# EasyEDA Pro project 立创·地阔星STM32F103C8T6开发板.eprj

# Schematic F103
Board Name: 地阔星STM32F103C8T6开发板; Create Date: 2024-06-13; Page Name: core; Project Name: 立创·地阔星STM32F103C8T6开发板; Schematic Name: F103; Update Date: 2024-06-13; BladeWidth: 10; Company: 嘉立创EDA; Page Size: A4; RegionStart: 1; Reviewed: 嘉立创EDA; ShowBorder: 1; TitleBlock: 1; TitleBlockPosition: 3; XRegionCount: 6; YRegionCount: 4
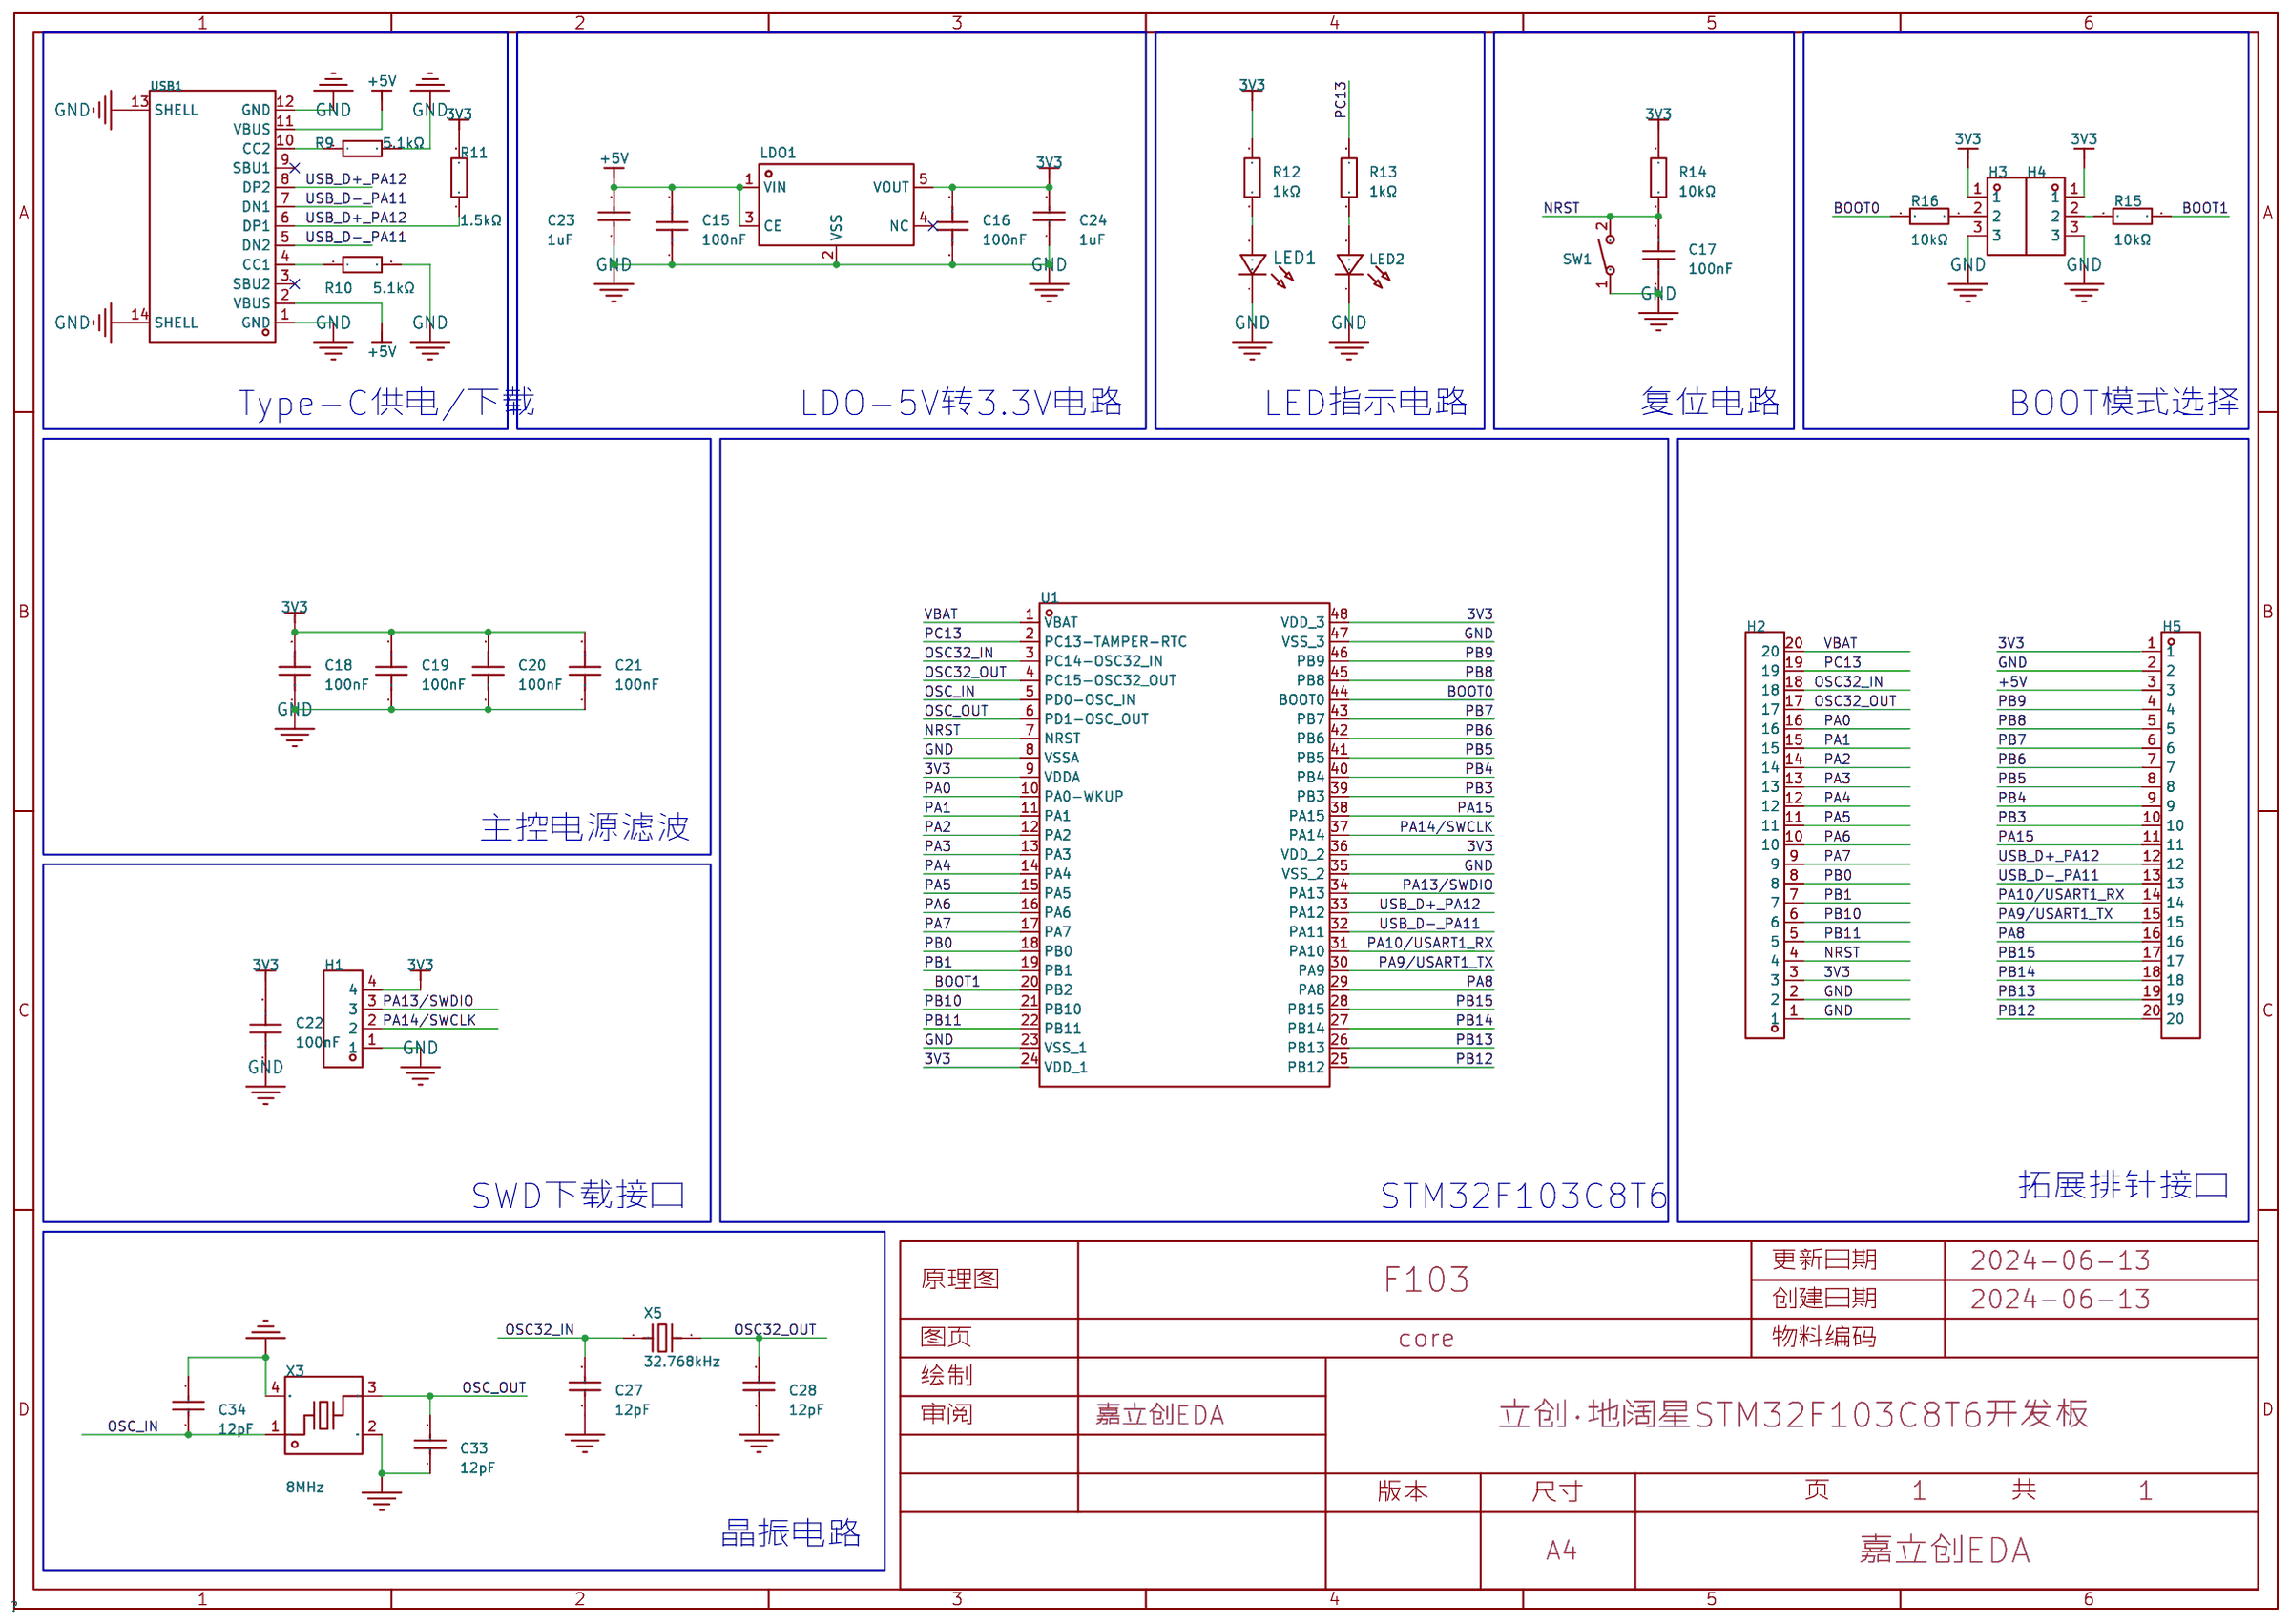
[diagram p0: schematic sheet]

## Parts
C15  100nF  [R0402]
C16  100nF  [R0402]
C17  100nF  [R0402]
C18  100nF  [R0402]
C19  100nF  [R0402]
C20  100nF  [R0402]
C21  100nF  [R0402]
C22  100nF  [R0402]
C23  1uF  [R0402]
C24  1uF  [R0402]
C27  12pF  [R0402]
C28  12pF  [R0402]
C33  12pF  [R0402]
C34  12pF  [R0402]
H1  -  [HDR-TH_4P-P2.54-V-M]
H2  -  [HDR-TH_20P-P2.54-V-M-1]
H3  -  [HDR-TH_3P-P2.54-V-M]
H4  -  [HDR-TH_3P-P2.54-V-M]
H5  -  [HDR-TH_20P-P2.54-V-M-1]
LDO1  ME6211C33M5G-N  [SOT-23-5_L3.0-W1.7-P0.95-LS2.8-BL]
LED1  -  [LED_0603]
LED2  -  [LED_0603]
R9  5.1kΩ  [R0402]
R10  5.1kΩ  [R0402]
R11  1.5kΩ  [R0402]
R12  1kΩ  [R0402]
R13  1kΩ  [R0402]
R14  10kΩ  [R0402]
R15  10kΩ  [R0402]
R16  10kΩ  [R0402]
SW1  TS-1101-B-W  [KEY-SMD_2P-L6.0-W3.6-P7.4-LS8.0-L]
U1  STM32F103C8T6  [LQFP-48_L7.0-W7.0-P0.50-LS9.0-BL]
USB1  TYPE-C 16PIN 2MD(073)  [USB-C-SMD_TYPE-C-6PIN-2MD-073]
X3  8MHz  [CRYSTAL-SMD_4P-L3.2-W2.5-BL-1]
X5  32.768kHz  [OSC-SMD_L3.2-W1.5]

## Library data of the parts
C15-C22 = GRM155R71H104KE14D: 容值:100nF;精度:±10%;额定电压:50V;材质(温度系数):X7R;; LCSC Part Name: 100nF ±10% 50V; Supplier Part: C77020; Manufacturer: muRata(村田); Supplier Footprint: 0402; JLCPCB Part Class: 扩展库; Datasheet: https://atta.szlcsc.com/upload/public/pdf/source/20180326/C77020_39BD49C951FF1AF0DB1F1FAC5AC1E401.pdf; Supplier: LCSC; Tolerance: ±10%; Voltage Rated: 50V; Temperature Coefficient: X7R
C23 C24 = CL05A105KP5NNNC: 容值:1uF;精度:±10%;额定电压:10V;材质(温度系数):X5R;; LCSC Part Name: 1uF ±10% 10V; Supplier Part: C14445; Manufacturer: SAMSUNG(三星); Supplier Footprint: 0402; JLCPCB Part Class: 扩展库; Datasheet: https://atta.szlcsc.com/upload/public/pdf/source/20160218/1457707763339.pdf; Supplier: LCSC; Tolerance: ±10%; Voltage Rated: 10V; Temperature Coefficient: X5R
C27 C28 C33 C34 = 0402CG120J500NT: 容值:12pF;精度:±5%;额定电压:50V;材质(温度系数):C0G;; LCSC Part Name: 12pF ±5% 50V; Supplier Part: C1547; Manufacturer: FH(风华); Supplier Footprint: 0402; JLCPCB Part Class: 基础库; Datasheet: https://atta.szlcsc.com/upload/public/pdf/source/20200305/C486355_26A10D38EF8C2A5C37091D0039909270.pdf; Supplier: LCSC; Tolerance: ±5%; Voltage Rated: 50V; Temperature Coefficient: C0G
H1 = HDR-M_2.54_1x4P: Supplier Part: C2935929; Supplier Footprint: 插件
H2 H5 = HDR-M_2.54_1x20P: 间距:2.54mm;总PIN位数:20;排数:1;插针结构:-;行距:-;安装类型:直插;圆针/方针:-;额定电流:-;额定电压:-;配合针长度:-;塑高:-;触头材质:黄铜;触头镀层:-;颜色:黑色;; Supplier Part: C50981; Supplier Footprint: 插件
H3 H4 = HDR-M_2.54_1x3P: Supplier Part: C2937625; Supplier Footprint: 插件
LDO1 = ME6211C33M5G-N: 输出类型:固定;输出极性:正;最大输入电压:6V;输出电压:3.3V;输出电流:500mA;电源纹波抑制比(PSRR):70dB;; Supplier Part: C82942; Manufacturer: MICRONE(南京微盟); Supplier Footprint: SOT-23-5; JLCPCB Part Class: 扩展库; Datasheet: https://atta.szlcsc.com/upload/public/pdf/source/20170918/C82942_1505727073070976520.pdf; Supplier: LCSC; Output Type: 固定; Output Polarity: 正; Number of Outputs: 1; Maximum Input Voltage: 6V; Output Voltage: 3.3V; Dropout Voltage: 260mV@(200mA); Output Current: 500mA; Power Supply Rejection Ratio (PSRR): 70dB
LED1 = LED_0603-R: Supplier Footprint: 0603; Supplier Part: C84263
LED2 = LED_0603-B: Supplier Footprint: 0603; Supplier Part: C84266
R9 R10 = 0402WGF5101TCE: 电阻类型:厚膜电阻;阻值:5.1kΩ;精度:±1%;功率:62.5mW;最大工作电压:50V;温度系数:±100ppm/℃;; LCSC Part Name: 5.1kΩ ±1% 62.5mW 厚膜电阻; Supplier Part: C25905; Manufacturer: UNI-ROYAL(厚声); Supplier Footprint: 0402; JLCPCB Part Class: 基础库; Datasheet: https://atta.szlcsc.com/upload/public/pdf/source/20200306/C422600_1E6D84923E4A46A82E41ADD87F860B5C.pdf; Supplier: LCSC; Type: 厚膜电阻; Tolerance: ±1%; Power(Watts): 62.5mW; Overload Voltage (Max): 50V; Temperature Coefficient: ±100ppm/℃; Operating Temperature Range: -55℃~+155℃
R11 = 0402WGF1501TCE: 电阻类型:厚膜电阻;阻值:1.5kΩ;精度:±1%;功率:62.5mW;最大工作电压:50V;温度系数:±100ppm/℃;; LCSC Part Name: 1.5kΩ ±1% 62.5mW 厚膜电阻; Supplier Part: C25867; Manufacturer: UNI-ROYAL(厚声); Supplier Footprint: 0402; JLCPCB Part Class: 基础库; Datasheet: https://atta.szlcsc.com/upload/public/pdf/source/20200306/C422600_1E6D84923E4A46A82E41ADD87F860B5C.pdf; Supplier: LCSC; Type: 厚膜电阻; Tolerance: ±1%; Power(Watts): 62.5mW; Overload Voltage (Max): 50V; Temperature Coefficient: ±100ppm/℃; Operating Temperature Range: -55℃~+155℃
R12 R13 = 0402WGF1001TCE: 电阻类型:厚膜电阻;阻值:1kΩ;精度:±1%;功率:62.5mW;最大工作电压:50V;温度系数:±100ppm/℃;; LCSC Part Name: 1kΩ ±1% 62.5mW 厚膜电阻; Supplier Part: C11702; Manufacturer: UNI-ROYAL(厚声); Supplier Footprint: 0402; JLCPCB Part Class: 基础库; Datasheet: https://atta.szlcsc.com/upload/public/pdf/source/20200306/C422600_1E6D84923E4A46A82E41ADD87F860B5C.pdf; Supplier: LCSC; Type: 厚膜电阻; Tolerance: ±1%; Power(Watts): 62.5mW; Overload Voltage (Max): 50V; Temperature Coefficient: ±100ppm/℃; Operating Temperature Range: -55℃~+155℃
R14-R16 = RC0402FR-0710KL: 电阻类型:厚膜电阻;阻值:10kΩ;精度:±1%;功率:62.5mW;最大工作电压:50V;温度系数:±100ppm/℃;; LCSC Part Name: 厚膜电阻 10kΩ ±1% 62.5mW; Supplier Part: C60490; Manufacturer: YAGEO(国巨); Supplier Footprint: 0402; JLCPCB Part Class: 扩展库; Datasheet: https://atta.szlcsc.com/upload/public/pdf/source/20170925/C131467_1506321478108990263.pdf; Supplier: LCSC; Type: 厚膜电阻; Tolerance: ±1%; Power(Watts): 62.5mW; Overload Voltage (Max): 50V; Temperature Coefficient: ±100ppm/℃; Operating Temperature Range: -55℃~+155℃
SW1 = TS-1101-B-W_C500065: 触点电流:50mA;额定电压(DC):12V;绝缘电阻:-;电路结构:单刀单掷;安装方式:立贴;带灯:无;作用力:160gf;机械寿命:5万次;带支架:否;; LCSC Part Name: 6*3.6*2.5mm 立贴 轻触开关; Supplier Part: C500065; Manufacturer: XKB Connectivity(中国星坤); Supplier Footprint: SMD; JLCPCB Part Class: 扩展库; Datasheet: https://atta.szlcsc.com/upload/public/pdf/source/20211011/D0E0CAF534F7B19DDE4CE68748A25BD3.pdf; Supplier: LCSC; Contact Current: 50mA; Voltage Rating (DC): 12V; Circuit: 单刀单掷; Mounting Style: 立贴; Actuator Style: 矩形按钮; Actuator/Cap Color: 白色; With Lamp: 无; Operating Force: 160gf; Mechanical Life: 5万次; Operating Temperature: -30℃~+85℃; Switch Length: 6mm; Switch Width: 3.6mm; Switch Height: 2.5mm; Strike Gundam: 否
U1 = STM32F103C8T6: CPU内核:CM3;程序存储容量:64KB;RAM总容量:20KB;GPIO端口数量:37;工作电压范围:2V~3.6V;CPU最大主频:72MHz;程序存储器类型:FLASH;; LCSC Part Name: STM32F103C8T6 MSL=3; Supplier Part: C8734; Manufacturer: ST(意法半导体); Supplier Footprint: LQFP-48(7x7); JLCPCB Part Class: 扩展库; Datasheet: https://atta.szlcsc.com/upload/public/pdf/source/20220812/8363ACEC51AD55ECEB84799464F7CB85.pdf; Supplier: LCSC; CPU Core: CM3; Program Storage Size: 64KB; RAM Size: 20KB; GPIO Ports Number: 37; Operating Voltage Range: 2V~3.6V; CPU Maximum Speed: 72MHz; Program Memory Type: FLASH; Operating Temperature Range: -40℃~+85℃; ADC (Bit): 12bit; Universal Serial Bus: 有; Peripheral/Function: 看门狗；DMA；看门狗；片载温度传感器; Watchdog: 有; Infrared Data Association: 有; Low-Voltage Detect: 有; Direct Memory Access: 有; Internal Oscillator: 有
USB1 = TYPE-C 16PIN 2MD(073): 连接器类型:Type-C;标准:-;公母:母座;触点数量:16;端口数量:1;安装方式:卧贴;额定电流 - 电源:5A;工作温度范围:-25℃~+85℃;; LCSC Part Name: TYPE-C母座 16P 4脚插件带定位柱 不锈钢外壳 2次模顶; Supplier Part: C2765186; Manufacturer: SHOU HAN(首韩); Supplier Footprint: SMD; JLCPCB Part Class: 扩展库; Supplier: LCSC; Connector Type: Type-C; Gender: 母座; Number of Contacts: 16; Number of Ports: 1; Mounting Style: 卧贴; Current Rating - Power (Max): 5A; Operating Temperature Range: -25℃~+85℃
X3 = XL2EL89COI-111YLC-8M: 晶振类型:贴片晶振;频率:8MHz;常温频差:±10ppm;外接负载电容:12pF;频率稳定度(全温):±20ppm;; LCSC Part Name: 8MHz ±10ppm 12pF; Supplier Part: C2973805; Manufacturer: YXC(扬兴晶振); Supplier Footprint: SMD3225-4P; JLCPCB Part Class: 扩展库; Datasheet: https://atta.szlcsc.com/upload/public/pdf/source/20240329/19D5F850207469550BEB00D7DFEDBC7A.pdf; Supplier: LCSC; Crystal Type: 贴片晶振; Normal temperature Frequency Tolerance: ±10ppm; External load capacitor: 12pF; Frequency Stability(Full temperature range): ±20ppm; Equivalent Series Resistance (ESR): 150Ω; Operating Temperature: -40℃~+85℃
X5 = X321532768KGD2SI: 晶振类型:贴片晶振;频率:32.768kHz;常温频差:±20ppm;外接负载电容:12.5pF;频率稳定度(全温):-;; LCSC Part Name: 32.768kHz ±20ppm 12.5pF; Supplier Part: C620155; Manufacturer: YXC(扬兴晶振); Supplier Footprint: SMD3215-2P; JLCPCB Part Class: 扩展库; Datasheet: https://atta.szlcsc.com/upload/public/pdf/source/20240329/3A7650FD985DD0DE85694D3785AB4916.pdf; Supplier: LCSC; Crystal Type: 贴片晶振; Normal temperature Frequency Tolerance: ±20ppm; External load capacitor: 12.5pF; Operating Temperature: -40℃~+85℃

## Nets
3V3: C16.2 C18.2 C19.2 C20.2 C21.2 C22.2 C24.2 H1.4 H2.3 H3.1 H4.1 H5.1 LDO1.5(VOUT) R11.2 R12.2 R14.2 U1.9(VDDA) U1.24(VDD_1) U1.36(VDD_2) U1.48(VDD_3)
+5V: C15.2 C23.2 H5.3 LDO1.1(VIN) LDO1.3(CE) USB1.2(VBUS) USB1.11(VBUS)
GND: C15.1 C16.1 C17.1 C18.1 C19.1 C20.1 C21.1 C22.1 C23.1 C24.1 C27.1 C28.1 C33.1 C34.2 H1.1 H2.1 H2.2 H3.3 H4.3 H5.2 LDO1.2(VSS) LED1.1(C) LED2.1(C) R9.2 R10.2 SW1.1 U1.8(VSSA) U1.23(VSS_1) U1.35(VSS_2) U1.47(VSS_3) USB1.1(GND) USB1.12(GND) USB1.13(SHELL) USB1.14(SHELL) X3.2(GND) X3.4(GND)
VBAT: H2.20 U1.1(VBAT)
BOOT0: R16.2 U1.44(BOOT0)
BOOT1: R15.1 U1.20(PB2)
NRST: C17.2 H2.4 R14.1 SW1.2 U1.7(NRST)
OSC32_IN: C27.2 H2.18 U1.3(PC14-OSC32_IN) X5.1
OSC32_OUT: C28.2 H2.17 U1.4(PC15-OSC32_OUT) X5.2
OSC_IN: C34.1 U1.5(PD0-OSC_IN) X3.1
OSC_OUT: C33.2 U1.6(PD1-OSC_OUT) X3.3
PA0: H2.16 U1.10(PA0-WKUP)
PA1: H2.15 U1.11(PA1)
PA2: H2.14 U1.12(PA2)
PA3: H2.13 U1.13(PA3)
PA4: H2.12 U1.14(PA4)
PA5: H2.11 U1.15(PA5)
PA6: H2.10 U1.16(PA6)
PA7: H2.9 U1.17(PA7)
PA8: H5.16 U1.29(PA8)
PA9/USART1_TX: H5.15 U1.30(PA9)
PA10/USART1_RX: H5.14 U1.31(PA10)
PA13/SWDIO: H1.3 U1.34(PA13)
PA14/SWCLK: H1.2 U1.37(PA14)
PA15: H5.11 U1.38(PA15)
PB0: H2.8 U1.18(PB0)
PB1: H2.7 U1.19(PB1)
PB3: H5.10 U1.39(PB3)
PB4: H5.9 U1.40(PB4)
PB5: H5.8 U1.41(PB5)
PB6: H5.7 U1.42(PB6)
PB7: H5.6 U1.43(PB7)
PB8: H5.5 U1.45(PB8)
PB9: H5.4 U1.46(PB9)
PB10: H2.6 U1.21(PB10)
PB11: H2.5 U1.22(PB11)
PB12: H5.20 U1.25(PB12)
PB13: H5.19 U1.26(PB13)
PB14: H5.18 U1.27(PB14)
PB15: H5.17 U1.28(PB15)
PC13: H2.19 R13.2 U1.2(PC13-TAMPER-RTC)
USB_D+_PA12: H5.12 R11.1 U1.33(PA12) USB1.6(DP1) USB1.8(DP2)
USB_D-_PA11: H5.13 U1.32(PA11) USB1.5(DN2) USB1.7(DN1)
$1N2054: R9.1 USB1.10(CC2)
$1N2066: R10.1 USB1.4(CC1)
$1N2074: LED1.2(A) R12.1
$1N2077: LED2.2(A) R13.1
$1N3296: H4.2 R15.2
$1N11047: H3.2 R16.1

Not connected (* = marked no-connect by the designer): LDO1 4(NC)*; USB1 3(SBU2)* 9(SBU1)*

## Notes on the sheet
- Type-C供电/下载
- LDO-5V转3.3V电路
- LED指示电路
- 复位电路
- BOOT模式选择
- 主控电源滤波
- SWD下载接口
- STM32F103C8T6
- 拓展排针接口
- 晶振电路

# Board PCB
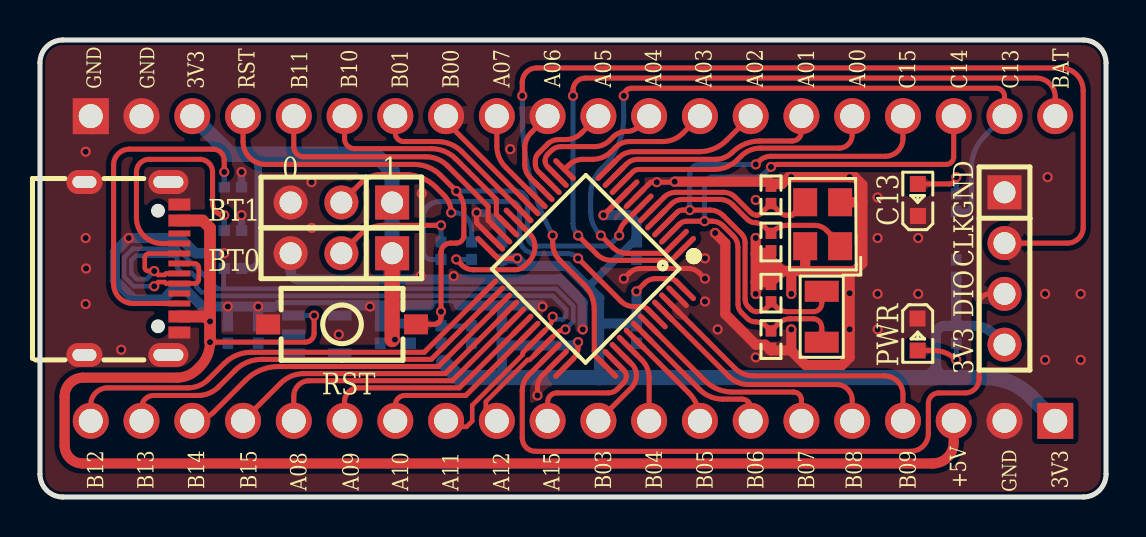
[diagram p1: board, top side]
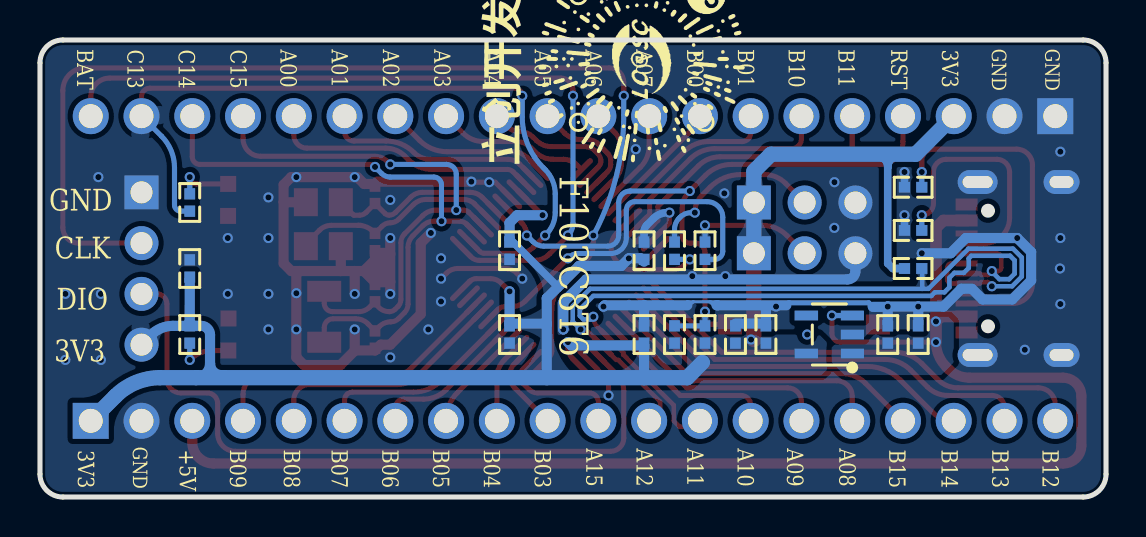
[diagram p2: board, bottom side, seen from below]

Outline 53.34 x 22.86 mm; copper layers: Top Layer, Bottom Layer. Coordinates in mm from the lower left corner of the outline.
Outline path: 0,21.72 0,1.14 arc(0.33,0.33) 1.14,0 52.2,0 arc(53.01,0.33) 53.34,1.14 53.34,21.72 arc(53.01,22.53) 52.2,22.86 1.14,22.86 arc(0.33,22.53) 0,21.72
Stack: Top Layer 0.035mm - / Dielectric1 1.51mm FR4 er 4.5 / Bottom Layer 0.035mm -

## Design rules (mm)
net USB_D-_PA11: DP1
net USB_D+_PA12: DP1
spacing copperThickness1oz (default): track to track 0.102, other pairs 0.152 to 0.3
spacing copperThickness2oz: track to track 0.203, other pairs 0.152 to 0.3
spacing Plane_innerPlane: track to track 0.102, other pairs 0.152 to 0.3
spacing Copper_copperRegion: track to track 0.102, other pairs 0.152 to 0.3
track width copperThickness1oz (default): min 0.152, default 0.254, max 2.54
track width copperThickness2oz: min 0.152, default 0.254, max 2.54
differential pair differentialPair (default): width min 0.229, default 0.229, max 0.229; gap min 0.127, default 0.127
pour e748 uses Copper_copperRegion
pour e750 uses Copper_copperRegion
pour e752 uses Copper_copperRegion
pour e767 uses Copper_copperRegion

## Placement (name value [footprint] x y rotation side)
C15  100nF  [R0402]  10.92 8.13 270 bottom
C16  100nF  [R0402]  17.02 8.13 270 bottom
C17  100nF  [R0402]  21.59 8.13 90 bottom
C18  100nF  [R0402]  23.11 8.13 270 bottom
C19  100nF  [R0402]  23.11 12.32 270 bottom
C20  100nF  [R0402]  29.84 12.32 90 bottom
C21  100nF  [R0402]  29.84 8.13 90 bottom
C22  100nF  [R0402]  45.85 11.43 270 bottom
C23  1uF  [R0402]  9.4 8.13 270 bottom
C24  1uF  [R0402]  18.54 8.13 270 bottom
C27  12pF  [R0402]  36.58 7.88 90 top
C28  12pF  [R0402]  36.58 10.2 270 top
C33  12pF  [R0402]  36.58 15.11 270 top
C34  12pF  [R0402]  36.58 12.75 270 top
H1  -  [HDR-TH_4P-P2.54-V-M]  48.26 11.43 270 top
H2  -  [HDR-TH_20P-P2.54-V-M-1]  26.67 19.05 0 top
H3  -  [HDR-TH_3P-P2.54-V-M]  15.08 12.19 180 top
H4  -  [HDR-TH_3P-P2.54-V-M]  15.08 14.73 180 top
H5  -  [HDR-TH_20P-P2.54-V-M-1]  26.67 3.81 180 top
LDO1  ME6211C33M5G-N  [SOT-23-5_L3.0-W1.7-P0.95-LS2.8-BL]  13.84 8.13 90 bottom
LED1  -  [LED_0603]  43.92 8.08 270 top
LED2  -  [LED_0603]  43.92 14.91 90 top
R9  5.1kΩ  [R0402]  9.65 15.49 0 bottom
R10  5.1kΩ  [R0402]  9.65 13.33 0 bottom
R11  1.5kΩ  [R0402]  9.65 11.43 0 bottom
R12  1kΩ  [R0402]  45.85 8.13 90 bottom
R13  1kΩ  [R0402]  45.85 14.73 270 bottom
R14  10kΩ  [R0402]  20.07 8.13 270 bottom
R15  10kΩ  [R0402]  21.59 12.32 90 bottom
R16  10kΩ  [R0402]  20.07 12.32 270 bottom
SW1  TS-1101-B-W  [KEY-SMD_2P-L6.0-W3.6-P7.4-LS8.0-L]  15.11 8.64 0 top
U1  STM32F103C8T6  [LQFP-48_L7.0-W7.0-P0.50-LS9.0-BL]  27.31 11.43 135 top
USB1  TYPE-C 16PIN 2MD(073)  [USB-C-SMD_TYPE-C-6PIN-2MD-073]  4.6 11.43 270 top
X3  8MHz  [CRYSTAL-SMD_4P-L3.2-W2.5-BL-1]  39.16 13.64 90 top
X5  32.768kHz  [OSC-SMD_L3.2-W1.5]  39.12 9.02 90 top

## Footprints (pads in the part's own frame, mm; a bottom-side part is the same pattern mirrored in y, then rotated)
CRYSTAL-SMD_4P-L3.2-W2.5-BL-1
  rect 1.4x1.2 smd: 1(-1.1,-0.875) 2(1.1,-0.875) 3(1.1,0.875) 4(-1.1,0.875)
HDR-TH_3P-P2.54-V-M
  rect 1.7x1.7 hole 1.1: 1(-2.54,0)
  round 1.7 hole 1.1: 2(0,0) 3(2.54,0)
HDR-TH_4P-P2.54-V-M
  rect 1.7x1.7 hole 1.1: 1(-3.81,0)
  round 1.7 hole 1.1: 2(-1.27,0) 3(1.27,0) 4(3.81,0)
HDR-TH_20P-P2.54-V-M-1
  rect 1.8x1.8 hole 1.2: 1(-24.13,0)
  round 1.8 hole 1.2: 2(-21.59,0) 3(-19.05,0) 4(-16.51,0) 5(-13.97,0) 6(-11.43,0) 7(-8.89,0) 8(-6.35,0) 9(-3.81,0) 10(-1.27,0) 11(1.27,0) 12(3.81,0) 13(6.35,0) 14(8.89,0) 15(11.43,0) 16(13.97,0) 17(16.51,0) 18(19.05,0) 19(21.59,0) 20(24.13,0)
KEY-SMD_2P-L6.0-W3.6-P7.4-LS8.0-L
  rect 1.2x1 smd: 1(-3.7,0) 2(3.7,0)
LED_0603
  rect 0.8x0.8 smd: 1(-0.851,-0.01) 2(0.75,-0.005)
LQFP-48_L7.0-W7.0-P0.50-LS9.0-BL
  oval 0.27x1.5 smd: 1(-2.75,-4.25) 2(-2.25,-4.25) 3(-1.75,-4.25) 4(-1.25,-4.25) 5(-0.75,-4.25) 6(-0.25,-4.25) 7(0.25,-4.25) 8(0.75,-4.25) 9(1.25,-4.25) 10(1.75,-4.25) 11(2.25,-4.25) 12(2.75,-4.25) 25(2.75,4.25) 26(2.25,4.25) 27(1.75,4.25) 28(1.25,4.25) 29(0.75,4.25) 30(0.25,4.25) 31(-0.25,4.25) 32(-0.75,4.25) 33(-1.25,4.25) 34(-1.75,4.25) 35(-2.25,4.25) 36(-2.75,4.25)
  oval 1.5x0.27 smd: 13(4.25,-2.75) 14(4.25,-2.25) 15(4.25,-1.75) 16(4.25,-1.25) 17(4.25,-0.75) 18(4.25,-0.25) 19(4.25,0.25) 20(4.25,0.75) 21(4.25,1.25) 22(4.25,1.75) 23(4.25,2.25) 24(4.25,2.75) 37(-4.25,2.75) 38(-4.25,2.25) 39(-4.25,1.75) 40(-4.25,1.25) 41(-4.25,0.75) 42(-4.25,0.25) 43(-4.25,-0.25) 44(-4.25,-0.75) 45(-4.25,-1.25) 46(-4.25,-1.75) 47(-4.25,-2.25) 48(-4.25,-2.75)
OSC-SMD_L3.2-W1.5
  rect 1.05x1.7 smd: 1(-1.275,0) 2(1.275,0)
R0402
  rect 0.566x0.54 smd: 1(-0.433,0) 2(0.433,0)
SOT-23-5_L3.0-W1.7-P0.95-LS2.8-BL
  rect 0.49x1.157 smd: 1(-0.95,-1.153) 2(0,-1.153) 3(0.95,-1.153)
  rect 0.49x1.175 smd: 4(0.95,1.153) 5(-0.95,1.153)
USB-C-SMD_TYPE-C-6PIN-2MD-073
  rect 0.6x1.1 smd: 1(-3.2,2.375) 2(-2.4,2.375) 11(2.4,2.375) 12(3.2,2.375)
  rect 0.3x1.1 smd: 3(-1.75,2.375) 4(-1.25,2.375) 5(-0.75,2.375) 6(-0.25,2.375) 7(0.25,2.375) 8(0.75,2.375) 9(1.25,2.375) 10(1.75,2.375)
  oval 1.2x2 hole 0.6x1.5: 13(-4.325,1.825) 14(4.325,1.825)
  oval 1.2x1.8 hole 0.6x1.2: 13(-4.325,-2.375) 14(4.325,-2.375)

## Nets
As in the schematic.

Pads without a net: LDO1 4; USB1 3 9

## Via types
v1: diameter 0.508, hole 0.305, Top Layer to Bottom Layer, 85 vias

## Routing (per net, layer and track width the routed paths; a pad name or vN(x,y) marks a point on that pad's centre or on a via; arc(x,y) is an arc through that point)
3V3: length 102.9
  Top Layer w0.254: v1(23.88,11.94) 22.91,11.94 U1.24 ; U1.36 26.7,6.94 arc(26.87,7.18) 26.92,7.48 v1(26.92,7.75) ; U1.48 31.83,10.79 arc(31.69,10.89) 31.52,10.92 30.8,10.92 arc(30.5,10.86) 30.26,10.7 v1(29.84,10.29)
  Top Layer w0.28: v1(28.19,14.1) 28.2,14.1 U1.9
  Top Layer w0.762: H3.1 17.62,7.87
  Bottom Layer w0.381: 10.09,11.43 10.67,11.43 10.92,11.68 10.92,16.51 ; 27.43,10.5 27.43,10.52 29.78,12.86 29.84,12.86 ; 10.92,16.64 10.92,17.02 ; 10.92,16.64 10.92,16.51 ; 10.92,16.64 arc(10.81,16.91) 10.54,17.02 ; 10.92,16.51 arc(11.07,16.87) 11.43,17.02 ; 10.92,16.51 arc(10.77,16.87) 10.41,17.02
  Bottom Layer w0.508: 27.98,8.67 27.98,5.97 ; 27.98,8.67 27.99,8.67 29.84,8.67 v1(29.84,10.29) ; 27.98,8.67 27.98,9.95 26.37,11.56 24.26,11.56 v1(23.88,11.94) 23.28,11.94 23.11,11.77 ; R12.2 46.7,8.56 arc(47.27,8.45) 47.76,8.12 H1.4 ; R12.2 45.85,10.89 ; R12.2 45.28,8.56 arc(44.96,8.43) 44.83,8.11 44.83,6.67 ; v1(26.92,7.75) 26.76,7.58 23.11,7.58 23.11,5.97 ; v1(28.19,14.1) 29.46,14.1 29.84,13.72 29.84,12.86 ; 44.83,6.67 44.83,6.1 ; 44.83,6.67 arc(44.66,6.26) 44.26,6.1 44.07,6.1 ; 44.83,6.67 arc(45.04,6.17) 45.53,5.97
  Bottom Layer w0.762: H5.1 49.56,5.05 arc(48.54,5.73) 47.34,5.97 20.96,5.97 20.19,6.73 ; H3.1 H4.1 17.62,16.29 16.76,17.14 9.53,17.14 H2.3
  vias: v1(17.76,7.87)
+5V: length 74.4
  Top Layer w0.254: v1(8.51,7.75) 13.27,7.75 arc(13.59,7.88) 13.72,8.19 v1(13.72,9.08)
  Top Layer w0.508: H5.3 45.72,2.73 arc(45.41,1.99) 44.67,1.68 2.13,1.68 arc(1.5,1.94) 1.23,2.58 1.23,5.04 arc(1.5,5.7) 2.16,5.97 6.84,5.97 arc(7.4,6.08) 7.88,6.4 8,6.52 arc(8.38,7.08) v1(8.51,7.75)
  Top Layer w0.584: USB1.11 8.26,9.03 v1(8.51,8.78) ; USB1.2 8.14,13.83 8.51,13.46 v1(8.51,8.78) ; v1(8.51,8.78) v1(8.51,7.75)
  Bottom Layer w0.254: LDO1.3 v1(13.72,9.08) 13.72,9.02
GND: length 115.3
  Top Layer w0.254: v1(21.85,14.22) 21.85,13.71 U1.23 ; U1.8 30.56,15.75 v1(30.86,15.75) 31.73,15.75 v1(31.76,15.77) ; v1(24.89,5.08) 24.89,5.49 arc(24.96,5.81) 25.14,6.08 25.89,6.83 ; v1(29.21,10.92) 29.48,11.2 arc(29.74,11.37) 30.05,11.43 32.45,11.43 arc(32.74,11.37) 32.99,11.2 v1(33.27,10.92)
  Top Layer w0.508: 41.15,14.75 41.15,11.68 40.77,11.3 40.36,11.3 ; 41.15,14.75 41.15,15.62 40.77,16 v1(40.51,16) 37.47,16 37.12,15.66 36.58,15.66 36.46,15.77 v1(31.76,15.77) ; 41.15,14.75 arc(41.14,14.75) 41.13,14.74 X3.2 ; v1(35.81,10.16) 35.81,10.76 ; 35.81,10.76 35.81,12.15 ; 35.81,10.76 35.83,10.74 36.58,10.74 ; 36.58,12.21 C34.2 arc(36.52,12.27) 36.48,12.21 ; 36.58,12.21 36.48,12.21 ; 36.58,12.21 36.58,11.86 ; 35.81,12.15 v1(35.81,12.95) ; 35.81,12.15 35.87,12.21 36.48,12.21 ; 36.58,10.74 36.58,11.86 ; 36.58,10.74 37.13,11.3 ; 37.6,11.3 37.59,11.3 v1(37.59,10.16) ; 37.6,11.3 37.13,11.3 ; 37.6,11.3 38.3,11.3 ; 37.58,7.33 36.58,7.33 36.29,7.62 35.82,7.62 34.29,9.15 34.29,12.7 v1(33.78,13.21) ; 37.58,7.33 37.59,7.35 v1(37.59,8.38) ; 37.58,7.33 38.3,6.6 40.13,6.6 40.51,6.98 v1(40.51,8.39) v1(40.51,10.19) 40.51,11.15 40.36,11.3 ; 36.19,11.05 36.19,11.4 arc(36.27,11.83) 36.48,12.21 ; 37.13,11.3 36.58,11.86 ; 40.36,11.3 38.3,11.3 ; X3.4 38.29,11.34 arc(38.29,11.32) 38.3,11.3
  Bottom Layer w0.152: 20.96,9.59 20.96,9.77 20.66,9.77 ; 20.66,9.77 19.82,9.77 ; 20.66,9.77 20.8,9.62 20.82,9.62 ; 19.82,9.77 19.43,9.77 19.43,9.59 ; 19.82,9.77 19.65,9.6
  Bottom Layer w0.254: 16,9.59 15.88,9.72 11.87,9.72 11.56,9.4
  Bottom Layer w0.381: 10.09,15.49 v1(10.09,16.26) ; 23.11,12.86 23.11,13.28 arc(23.08,13.45) 22.99,13.59 22.64,13.93 arc(22.32,14.15) 21.94,14.22 v1(21.85,14.22) ; 10.09,13.33 v1(10.09,14.1)
  Bottom Layer w0.508: 23.11,9.59 23.11,9.58 23.11,8.67 ; 23.11,9.59 20.96,9.59 ; 23.11,9.59 25.08,9.59 v1(25.15,9.53) ; 16,9.59 19.49,9.59 ; 11.67,9.51 10.94,9.51 v1(10.92,9.53) ; v1(10.92,9.53) v1(9.4,9.53) ; v1(10.92,9.53) 10.92,8.67 ; 18.54,8.67 17.02,8.67 17.02,9.53 ; v1(9.4,9.53) 8.13,9.53 7.24,10.41 6.71,10.41 6.18,9.88 4.69,9.88 3.75,10.83 3.75,12.26 v1(4.44,12.95) 7.01,12.95 7.78,12.19 v1(9.22,12.19) ; v1(9.4,9.53) 9.4,8.67 ; H3.3 12.54,11.29 arc(12.66,11) 12.94,10.88 26.01,10.88 27.15,9.74 27.15,8.39 v1(27.16,8.38)
  vias: v1(2.29,17.27) v1(2.29,12.95) v1(2.31,11.43) v1(2.29,9.65) v1(4.06,7.37) v1(13.59,15.75) v1(13.59,13.46) v1(14.95,8.13) v1(16.51,9.53) v1(19.1,15.19) v1(19.05,11.05) v1(20.7,11.05) v1(23.53,17.4) v1(33.27,11.94) v1(33.27,9.78) v1(33.91,8.38) v1(35.81,14.86) v1(35.81,6.98) v1(37.59,16) v1(41.91,14.99) v1(41.91,12.95) v1(41.91,10.16) v1(41.91,8.38) v1(43.94,12.95) v1(43.94,10.16) v1(50.29,10.16) v1(50.29,6.86) v1(50.42,16) v1(52.07,10.16) v1(52.07,6.86)
VBAT: length 39.4
  Top Layer w0.254: H2.20 50.8,20.01 arc(50.52,20.68) 49.85,20.95 27.28,20.95 arc(26.85,20.78) 26.67,20.35 v1(26.67,20.07) ; U1.1 31.77,12 arc(31.58,11.88) 31.36,11.84 28.61,11.84 arc(28.2,11.92) 27.86,12.15 v1(26.92,13.08)
  Bottom Layer w0.254: v1(26.67,20.07) 26.67,13.69 arc(26.74,13.36) v1(26.92,13.08)
BOOT0: length 18.3
  Top Layer w0.254: v1(26.92,11.94) 29.07,9.8 arc(29.37,9.6) 29.72,9.53 30.06,9.53 arc(30.26,9.49) 30.42,9.38 U1.44
  Bottom Layer w0.254: R16.2 19.58,11.89 arc(19.29,12) 19.18,12.29 19.18,13.99 arc(19.41,14.54) 19.96,14.77 23.58,14.77 arc(23.88,14.65) 24,14.35 24,12.95 arc(24.23,12.41) 24.78,12.18 26.4,12.18 arc(26.66,12.13) 26.88,11.98 v1(26.92,11.94)
BOOT1: length 7.3
  Top Layer w0.254: v1(20.83,11.89) 21.12,11.6 arc(21.37,11.43) 21.67,11.37 23.8,11.37 arc(24.04,11.42) 24.25,11.56 24.45,11.76 arc(24.68,12.11) 24.76,12.52 arc(24.69,12.88) 24.49,13.18 U1.20
  Bottom Layer w0.254: R15.1 v1(20.83,11.89)
NRST: length 36.6
  Top Layer w0.254: SW1.2 19.71,8.64 arc(19.96,8.74) 20.07,8.99 v1(20.07,9.27) 20.07,12.23 arc(20.2,12.56) 20.54,12.7 20.83,12.7 arc(21.1,12.81) 21.21,13.08 21.21,14.41 arc(21.11,14.89) 20.85,15.29 v1(20.83,15.31) 20.04,16.09 arc(19.44,16.49) 18.72,16.64 11.3,16.64 arc(10.49,16.97) 10.16,17.78 H2.4 ; U1.7 29.25,13.73 arc(29.05,13.43) v1(28.98,13.08)
  Bottom Layer w0.254: 21.59,8.67 21.48,8.56 R14.1 v1(20.07,9.27) ; v1(28.98,13.08) 28.67,12.77 arc(28.42,12.6) 28.14,12.55 24.93,12.55 arc(24.54,12.71) 24.38,13.09 24.38,14.73 arc(24.22,15.14) 23.81,15.31 v1(20.83,15.31)
OSC32_IN: length 30.1
  Top Layer w0.254: H2.18 45.72,17.02 arc(45.61,16.75) 45.34,16.64 36.88,16.64 arc(36.72,16.6) v1(36.58,16.51) ; U1.3 32.01,13.66 arc(32.16,13.76) 32.34,13.79 v1(33.25,13.79) 33.63,13.79 arc(33.93,13.73) 34.19,13.56 34.68,13.07 arc(34.86,12.8) 34.93,12.48 34.93,9.65 arc(34.97,9.42) 35.1,9.22 35.4,8.92 arc(35.58,8.81) 35.79,8.76 arc(36.1,8.7) 36.36,8.53 36.58,8.31 36.93,8.66 arc(37.21,8.85) 37.54,8.92 38.68,8.92 arc(38.99,8.79) 39.12,8.48 X5.1
  Bottom Layer w0.254: v1(33.25,13.79) 33.25,15.62 arc(33.36,15.89) 33.63,16 35.8,16 arc(36.05,16.05) 36.25,16.19 v1(36.58,16.51)
OSC32_OUT: length 27.9
  Top Layer w0.254: U1.4 31.88,14.24 arc(32.01,14.32) 32.15,14.35 v1(32.51,14.35) 33.52,14.35 arc(33.88,14.28) 34.18,14.08 35.1,13.16 arc(35.23,12.96) 35.28,12.73 35.28,9.88 arc(35.32,9.69) 35.43,9.53 35.56,9.39 arc(35.7,9.3) 35.86,9.27 arc(36.3,9.41) C28.2 36.84,9.5 arc(37.1,9.33) 37.4,9.27 38.7,9.27 arc(38.99,9.39) 39.12,9.69 X5.2 ; H2.17 43.18,17.93 arc(42.92,17.3) 42.29,17.04 36.58,17.04 arc(36.25,16.98) 35.97,16.79 v1(35.81,16.64)
  Bottom Layer w0.254: v1(32.51,14.35) 32.51,16.15 arc(32.65,16.49) 33,16.64 v1(35.81,16.64)
OSC_IN: length 10.9
  Top Layer w0.254: 37.42,13.59 38.76,13.59 arc(39.08,13.52) 39.36,13.34 40.04,12.66 X3.1 ; 37.42,13.59 37.27,13.59 ; 37.42,13.59 arc(37.01,13.51) 36.66,13.27 C34.1 36.22,13.55 arc(36.03,13.67) 35.81,13.72 arc(35.58,13.76) 35.39,13.89 34.67,14.61 arc(34.37,14.81) 34.01,14.88 32.14,14.88 arc(31.84,14.83) 31.59,14.66 U1.5
OSC_OUT: length 9.3
  Top Layer w0.254: 30.49,14.26 31.22,14.99 arc(31.5,15.18) 31.82,15.24 34.19,15.24 arc(34.52,15.18) 34.79,14.99 35.55,14.23 arc(35.7,14.13) 35.88,14.1 arc(35.98,14.12) 36.08,14.18 C33.2 37.02,14.23 arc(37.17,14.13) 37.35,14.1 37.64,14.1 X3.3
PA0: length 13.5
  Top Layer w0.254: U1.10 29.67,16.27 arc(29.8,16.35) 29.95,16.38 33.71,16.38 arc(34.36,16.51) 34.92,16.88 35.09,17.06 arc(35.53,17.35) 36.04,17.45 39.98,17.45 arc(40.45,17.64) 40.64,18.11 H2.16
PA1: length 11
  Top Layer w0.254: U1.11 29.34,16.65 arc(29.61,16.83) 29.92,16.89 33.81,16.89 arc(34.25,16.98) 34.63,17.23 arc(35.27,17.66) 36.02,17.81 37.63,17.81 arc(37.96,17.94) 38.1,18.27 H2.15
PA2: length 8.2
  Top Layer w0.254: H2.14 34.35,17.84 arc(33.72,17.42) 32.98,17.27 29.69,17.27 arc(29.29,17.19) 28.95,16.97 U1.12
PA3: length 7.7
  Top Layer w0.254: H2.13 32.17,18.2 arc(31.71,17.89) 31.16,17.78 29.5,17.78 arc(29.12,17.7) 28.79,17.48 28.58,17.28 arc(28.15,16.99) 27.65,16.89 27.16,16.89 arc(26.79,16.82) 26.47,16.61 U1.13
PA4: length 7.1
  Top Layer w0.254: 25.89,16.03 25.39,16.52 arc(25.3,16.66) 25.27,16.81 arc(25.31,17) 25.42,17.16 25.57,17.31 arc(25.8,17.47) 26.08,17.53 27.74,17.53 arc(28.16,17.61) 28.51,17.84 28.67,18 arc(28.99,18.21) 29.36,18.29 arc(29.69,18.35) 29.97,18.54 H2.12
PA5: length 5.5
  Top Layer w0.254: U1.15 24.94,16.27 arc(24.82,16.44) 24.78,16.64 24.78,16.83 arc(24.82,17.02) 24.93,17.19 25.4,17.65 arc(25.43,17.68) 25.46,17.7 arc(25.69,17.84) 25.95,17.88 26.32,17.88 arc(26.74,17.97) 27.09,18.2 H2.11
PA6: length 4.5
  Top Layer w0.254: U1.16 24.53,15.98 arc(24.33,16.27) 24.26,16.63 24.26,17.45 arc(24.34,17.87) 24.58,18.23 H2.10
PA7: length 4.8
  Top Layer w0.254: U1.17 23.3,16.5 arc(22.97,16.98) 22.86,17.55 H2.9
PA8: length 14
  Top Layer w0.254: U1.29 20.63,5.82 13.47,5.82 arc(12.93,5.59) 12.7,5.04 H5.16
PA9/USART1_TX: length 11.5
  Top Layer w0.254: H5.15 15.24,4.77 arc(15.44,5.26) 15.93,5.46 20.98,5.46 U1.30
PA10/USART1_RX: length 9.1
  Top Layer w0.254: H5.14 17.78,4.6 arc(17.92,4.94) 18.26,5.08 21.31,5.08 U1.31
PA13/SWDIO: length 36
  Top Layer w0.254: H1.3 47.49,10.16 arc(47.14,10.01) 46.99,9.66 46.99,5.9 arc(46.79,5.41) 46.29,5.21 44.98,5.21 arc(44.6,5.05) 44.45,4.68 44.45,3.17 arc(44.19,2.55) 43.56,2.29 24.79,2.29 arc(24.32,2.48) 24.13,2.95 24.13,5.31 arc(24.22,5.74) 24.46,6.11 U1.34
PA14/SWCLK: length 55.8
  Top Layer w0.254: U1.37 27.86,6.98 arc(27.77,7.13) 27.73,7.3 27.73,9.4 arc(27.73,9.52) 27.72,9.64 arc(27.7,9.75) 27.67,9.86 arc(27.5,10.27) 27.23,10.62 26.01,11.83 arc(25.75,12.23) 25.65,12.7 v1(25.65,13.08) ; H1.2 51.41,12.7 arc(51.97,12.93) 52.2,13.49 52.2,20.33 arc(51.87,21.13) 51.06,21.46 24.85,21.46 arc(24.34,21.25) 24.13,20.74 v1(24.13,20.07)
  Bottom Layer w0.254: v1(24.13,20.07) 24.13,19.1 arc(24.17,18.09) 24.29,17.08 arc(24.8,15.03) v1(25.65,13.08)
PA15: length 6.6
  Top Layer w0.254: H5.11 25.4,4.74 arc(25.54,5.07) 25.86,5.21 28.44,5.21 arc(28.68,5.26) 28.89,5.39 29.19,5.7 arc(29.3,5.86) 29.34,6.04 arc(29.31,6.2) 29.21,6.34 U1.38
PB0: length 6.1
  Top Layer w0.254: U1.18 20.52,18.57 arc(20.37,18.79) H2.8
PB1: length 8.8
  Top Layer w0.254: H2.7 17.78,18.2 arc(17.9,17.9) 18.2,17.78 19.88,17.78 arc(20.55,17.65) 21.11,17.27 U1.19
PB3: length 4.4
  Top Layer w0.254: U1.39 29.62,6.64 arc(29.79,6.39) 29.84,6.09 arc(29.78,5.74) 29.58,5.45 H5.10
PB4: length 4.1
  Top Layer w0.254: H5.9 30.48,5.96 arc(30.38,6.45) 30.11,6.86 U1.40
PB5: length 5.3
  Top Layer w0.254: U1.41 32.46,5.22 arc(32.87,4.59) 33.02,3.86 H5.8
PB6: length 7.6
  Top Layer w0.254: H5.7 35.56,4.47 arc(35.43,4.77) 35.13,4.89 34.16,4.89 arc(33.54,5.02) 33.01,5.37 U1.42
PB7: length 10.2
  Top Layer w0.254: 30.49,8.6 33.26,5.82 arc(33.9,5.4) 34.65,5.25 37.71,5.25 arc(37.98,5.14) 38.1,4.86 H5.6
PB8: length 12.4
  Top Layer w0.254: H5.5 40.64,4.85 arc(40.41,5.4) 39.86,5.62 35.47,5.62 arc(34.92,5.73) 34.46,6.04 U1.45
PB9: length 14.9
  Top Layer w0.254: U1.46 34.75,6.46 arc(35.19,6.16) 35.72,6.06 42.25,6.06 arc(42.91,5.79) 43.18,5.13 H5.4
PB10: length 11.6
  Top Layer w0.254: U1.21 22.83,14.13 22.83,14.89 20.8,16.92 arc(20.24,17.29) 19.57,17.42 15.74,17.42 arc(15.39,17.57) 15.24,17.92 H2.6
PB11: length 14.1
  Top Layer w0.254: U1.22 22.42,13.84 22.42,14.53 20.38,16.57 arc(19.89,16.9) 19.31,17.02 13.19,17.02 arc(12.84,17.16) 12.7,17.51 H2.5
PB12: length 23
  Top Layer w0.254: H5.20 2.54,4.61 arc(2.79,5.21) 3.39,5.46 7.41,5.46 arc(7.96,5.57) 8.42,5.88 9.21,6.67 arc(9.84,7.09) 10.58,7.24 19.22,7.24 U1.25
PB13: length 20.5
  Top Layer w0.254: H5.19 5.08,4.47 arc(5.26,4.9) 5.69,5.08 7.91,5.08 arc(8.46,5.19) 8.93,5.5 9.77,6.34 arc(10.37,6.74) 11.08,6.88 19.58,6.88 U1.26
PB14: length 17.7
  Top Layer w0.254: U1.27 19.93,6.53 11.94,6.53 arc(11.05,6.35) 10.29,5.85 8.7,4.26 arc(8.21,3.93) H5.18
PB15: length 15.5
  Top Layer w0.254: U1.28 20.28,6.17 13.21,6.17 arc(12.57,6.05) 12.04,5.69 H5.17
PC13: length 38.5
  Top Layer w0.254: v1(28.07,13.08) 28.66,12.49 arc(28.99,12.27) 29.38,12.19 31.12,12.19 arc(31.24,12.22) 31.34,12.28 31.9,12.84 ; H2.19 48.26,20.04 arc(48.14,20.33) 47.85,20.45 29.59,20.45 arc(29.32,20.34) v1(29.21,20.07)
  Bottom Layer w0.254: 45.85,14.3 46.3,14.3 arc(46.52,14.39) 46.61,14.61 46.61,16.48 arc(46.78,17.33) 47.26,18.05 H2.19 ; v1(28.07,13.08) 28.01,13.13 arc(27.68,13.64) 27.56,14.23 27.56,15.16 arc(27.69,15.82) 28.07,16.38 28.16,16.47 arc(28.4,16.74) 28.6,17.02 arc(29.06,17.97) 29.21,19.01 v1(29.21,20.07)
USB_D+_PA12: length 39.6
  Top Layer w0.229: USB1.6 7.73,11.68 arc(7.89,11.62) 7.95,11.47 7.95,10.88 arc(7.89,10.74) 7.74,10.68 USB1.8 6.31,10.68 6.24,10.75 5.93,10.75 v1(5.72,10.54) ; H5.12 22.85,3.81 22.31,4.35 22.31,4.77 24.4,6.86 24.5,6.86 U1.33 25.84,8.19 arc(26.04,8.33) v1(26.29,8.38)
  Bottom Layer w0.229: 9.2,10.41 8.89,10.41 6.88,12.42 4.65,12.42 4.22,11.98 4.22,11.02 4.7,10.54 v1(5.72,10.54) ; 9.2,10.41 9.2,11.41 R11.1 ; 9.2,10.41 25.81,10.41 26.68,9.55 26.68,8.78 v1(26.29,8.38)
USB_D-_PA11: length 39.4
  Top Layer w0.229: USB1.5 5.46,12.18 arc(5.31,12.12) 5.24,11.97 5.24,11.47 arc(5.29,11.35) 5.41,11.3 v1(5.72,11.3) 5.91,11.11 6.24,11.11 6.31,11.18 USB1.7 ; H5.13 20.62,3.51 21.34,3.51 21.63,3.8 21.63,4.59 24.16,7.12 24.16,7.22 U1.32 25.44,8.51 arc(25.6,8.74) v1(25.65,9.02)
  Bottom Layer w0.229: v1(25.65,9.02) 25.79,8.88 26.15,8.88 26.33,9.06 26.33,9.39 25.65,10.06 8.74,10.06 8.56,10.24 8.09,10.24 7.84,10.49 7.84,10.96 7.59,11.21 7.12,11.21 6.87,11.46 6.87,11.93 6.74,12.06 4.8,12.06 4.57,11.84 4.57,11.17 4.85,10.9 5.33,10.9 5.72,11.28 v1(5.72,11.3)
$1N2054: length 17.4
  Top Layer w0.254: v1(9.22,16.26) 9.22,16.83 arc(9.05,17.23) 8.65,17.4 4.47,17.4 arc(3.91,17.17) 3.68,16.61 3.68,10.67 arc(3.97,9.97) 4.67,9.68 USB1.10
  Bottom Layer w0.254: R9.1 v1(9.22,16.26)
$1N2066: length 13
  Top Layer w0.254: USB1.4 6.12,12.68 arc(5.2,13.06) 4.83,13.97 4.83,16.26 arc(5.01,16.71) 5.46,16.89 8,16.89 arc(8.45,16.71) 8.64,16.26 8.64,14.68 arc(8.81,14.27) v1(9.22,14.1)
  Bottom Layer w0.254: R10.1 v1(9.22,14.1)
$1N2074: length 2.9
  Top Layer w0.254: LED1.2 44.71,7.33 arc(45.33,7.21) v1(45.85,6.86)
  Bottom Layer w0.254: R12.1 v1(45.85,6.86)
$1N2077: length 3
  Top Layer w0.254: LED2.2 45.5,15.66 arc(45.75,15.76) v1(45.85,16)
  Bottom Layer w0.254: R13.1 v1(45.85,16)
$1N3296: length 9.1
  Top Layer w0.254: H4.2 16.04,15.69 arc(16.52,16.02) 17.09,16.13 18.28,16.13 arc(19.11,15.96) 19.81,15.49 20.22,15.09 arc(20.48,14.69) v1(20.57,14.22)
  Bottom Layer w0.254: R15.2 21.59,13.39 arc(21.53,13.69) 21.36,13.94 21.31,14 arc(21.06,14.17) 20.76,14.22 v1(20.57,14.22)
$1N11047: length 6.3
  Top Layer w0.254: H3.2 15.97,13.08 arc(16.53,13.46) 17.19,13.59 v1(20.07,13.59)
  Bottom Layer w0.254: v1(20.07,13.59) R16.1

## Copper pours and planes (outline as drawn; the poured copper is in the pictures)
3V3 on Bottom Layer: 14.35,8.13 13.97,7.75 13.97,6.35 14.22,6.1 20.57,6.1 20.96,6.48 20.96,7.87 20.7,8.13
+5V on Bottom Layer: 9.13,8.13 8.9,8.35 8.9,8.88 8.76,9.02 7.87,9.02 7.62,8.76 7.62,6.73 8.25,6.1 13.09,6.1 13.73,6.74 13.73,7.48 13.59,7.62 12.1,7.62 11.59,8.13
GND on Top Layer: -1,24 54,24 54,-1 -1,-1
GND on Bottom Layer: -1,24 53.75,24 53.75,-1 -1,-1

Small or netless copper shapes (teardrops, artwork), in the pictures only: 108 on Top Layer, 53 on Bottom Layer

## Text on the board
Bottom Silkscreen Layer: GND | B12 | B13 | 3V3 | B14 | RST | B15 | A08 | B11 | B10 | A09 | B01 | A10 | A11 | B00 | A12 | A07 | A15 | A06 | A05 | B03 | A04 | B04 | A03 | B05 | A02 | B06 | A01 | B07 | B08 | A00 | C15 | B09 | +5V | C14 | C13 | BAT | DIO | CLK | F103C8T6
Top Silkscreen Layer: GND | B12 | B13 | 3V3 | B14 | RST | B15 | A08 | B11 | B10 | A09 | B01 | A10 | A11 | B00 | A12 | A07 | A15 | A06 | A05 | B03 | A04 | B04 | A03 | B05 | A02 | B06 | A01 | B07 | B08 | A00 | C15 | B09 | +5V | C14 | C13 | BAT | CLK | DIO | BT1 | BT0 | 0 | 1 | PWR
